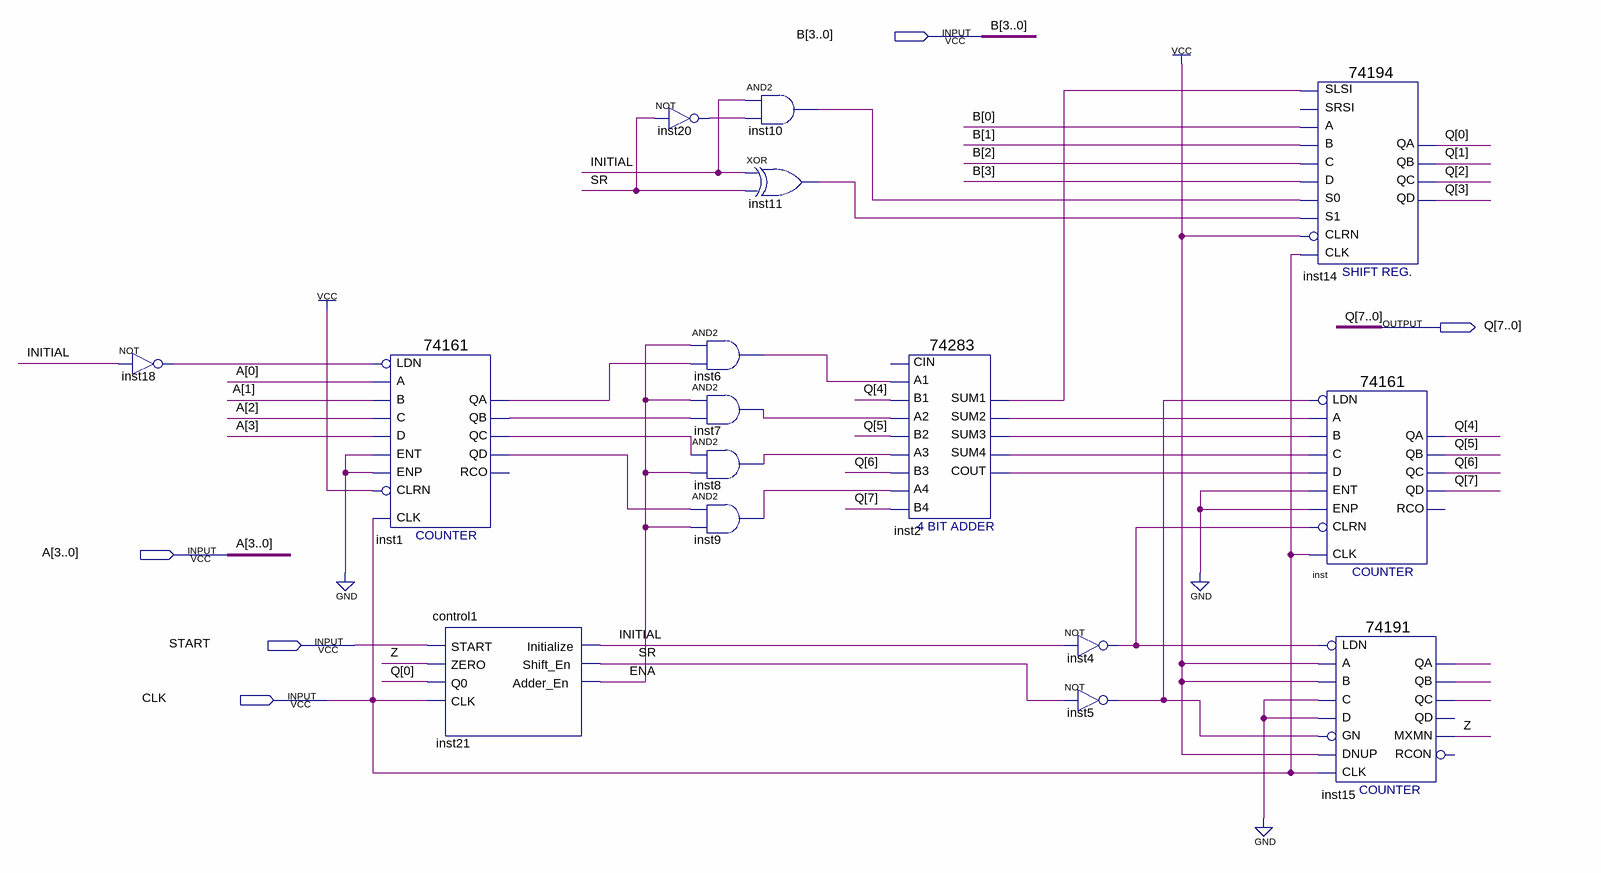
[diagram p0: schematic sheet]
// Quartus schematic multer.bdf as structural Verilog: 16 symbols, 5 pins
module multer (
  input  [3:0] B,
  input  [3:0] A,
  input  START,
  input  CLK,
  output [7:0] Q
);

  wire ENA, INITIAL, inst1_qa, inst1_qb, inst1_qc, inst1_qd, inst2_cout, inst2_sum1, inst2_sum2, inst2_sum3,
       inst2_sum4, inst4_out, inst5_out, inst6_out, inst7_out, inst8_out, inst9_out, inst10_out, inst11_out,
       inst15_qa, inst15_qb, inst15_qc, inst18_out, inst20_out, SR, Z;

  not inst18 (inst18_out, INITIAL);
  \74161  inst1 (
    .CLRN(1'b1), .CLK(CLK), .ENP(1'b0), .LDN(inst18_out), .A(A[0]), .D(A[3]), .ENT(1'b0), .B(A[1]), .C(A[2]),
    .QD(inst1_qd), .QC(inst1_qc), .QB(inst1_qb), .QA(inst1_qa));  // open: RCO
  control1 inst21 (.START(START), .ZERO(Z), .Q0(Q[0]), .CLK(CLK), .Initialize(INITIAL), .Shift_En(SR), .Adder_En(ENA));
  not inst20 (inst20_out, SR);
  and inst6 (inst6_out, ENA, inst1_qa);
  and inst7 (inst7_out, ENA, inst1_qb);
  and inst8 (inst8_out, inst1_qc, ENA);
  and inst9 (inst9_out, inst1_qd, ENA);
  and inst10 (inst10_out, INITIAL, inst20_out);
  xor inst11 (inst11_out, INITIAL, SR);
  \74283  inst2 (
    .A1(inst6_out), .A2(inst7_out), .B2(Q[5]), .A3(inst8_out), .A4(inst9_out), .B4(Q[7]), .B1(Q[4]),
    .B3(Q[6]), .SUM4(inst2_sum4), .COUT(inst2_cout), .SUM1(inst2_sum1), .SUM2(inst2_sum2), .SUM3(inst2_sum3));  // open: CIN
  not inst4 (inst4_out, INITIAL);
  not inst5 (inst5_out, SR);
  \74194  inst14 (
    .SLSI(inst2_sum1), .B(B[1]), .C(B[2]), .CLK(CLK), .CLRN(1'b1), .D(B[3]), .S1(inst11_out),
    .S0(inst10_out), .A(B[0]), .QA(Q[0]), .QB(Q[1]), .QC(Q[2]), .QD(Q[3]));  // open: SRSI
  \74161  inst (
    .CLRN(inst4_out), .CLK(CLK), .ENP(1'b0), .LDN(inst5_out), .A(inst2_sum2), .D(inst2_cout), .ENT(1'b0),
    .B(inst2_sum3), .C(inst2_sum4), .QD(Q[7]), .QC(Q[6]), .QB(Q[5]), .QA(Q[4]));  // open: RCO
  \74191  inst15 (
    .LDN(inst4_out), .D(1'b0), .C(1'b0), .B(1'b1), .A(1'b1), .CLK(CLK), .DNUP(1'b1), .GN(inst5_out),
    .MXMN(Z), .QA(inst15_qa), .QB(inst15_qb), .QC(inst15_qc));  // open: RCON, QD
endmodule
